# Altium schematic sheet CATZILLA.SchDoc: =DocumentName
size 420 x 297 mm; CompanyName: "AS Manufacturing" LLC; Organization: "AS Manufacturing" LLC; Address1: 5 Sklyarenka St.; Address2: Kyiv 04073; Address3: Ukraine; Address4: https://ajax.systems/en/; DocumentNumber: 3; SheetNumber: 3; SheetTotal: 6; Template_version: 1.0.1
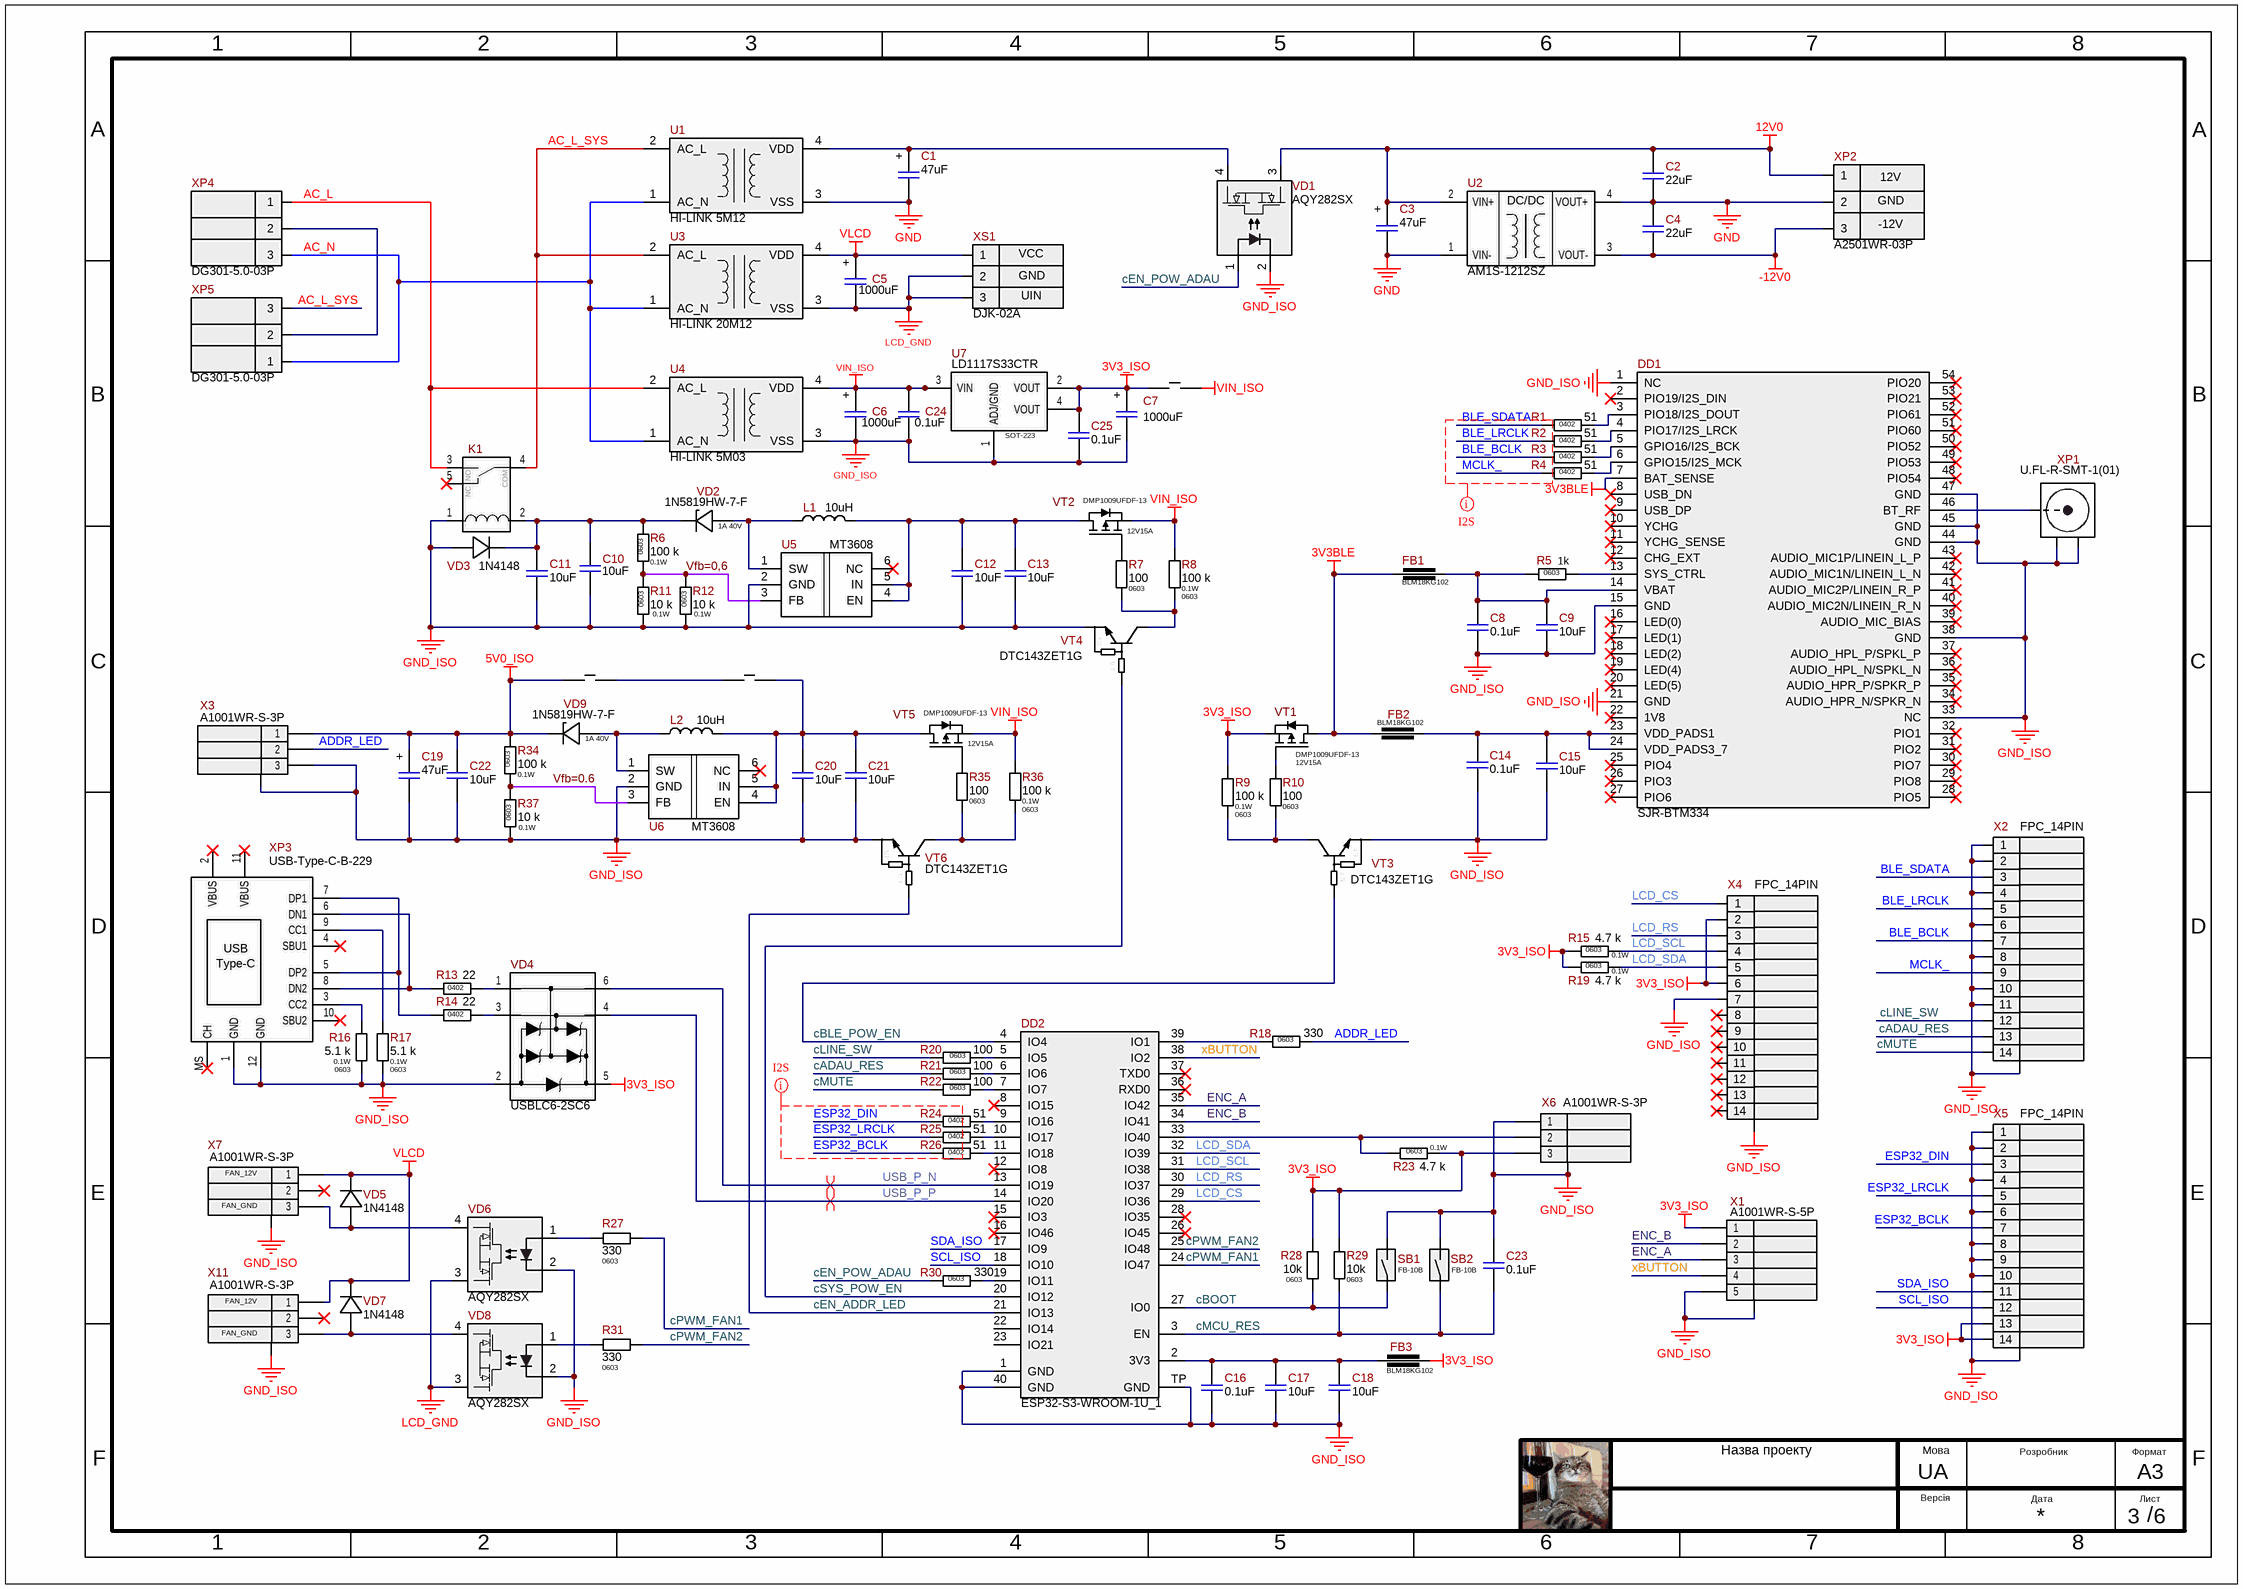
[diagram p0: CATZILLA.SchDoc]

## Parts
C1  47uF  [CAP 6.3x6]
C2  22uF  [C1206(3216)]
C3  47uF  [CAP 6.3x6]
C4  22uF  [C1206(3216)]
C5  1000uF  [CAP 10x16]
C6  1000uF  [CAP-AE-830x1000H50_HI]
C7  1000uF  [CAP-AE-830x1000H50_HI]
C8  0.1uF  [C0603(1608)]
C9  10uF  [C0603(1608)]
C10  10uF  [C0805(2012)]
C11  10uF  [C0805(2012)]
C12  10uF  [C0805(2012)]
C13  10uF  [C0805(2012)]
C14  0.1uF  [C0603(1608)]
C15  10uF  [C0603(1608)]
C16  0.1uF  [C0603(1608)]
C17  10uF  [C0603(1608)]
C18  10uF  [C0603(1608)]
C19  47uF  [CAP 6.3x6]
C20  10uF  [C0805(2012)]
C21  10uF  [C0805(2012)]
C22  10uF  [C0805(2012)]
C23  0.1uF  [C0603(1608)]
C24  0.1uF  [C0603(1608)]
C25  0.1uF  [C0603(1608)]
DD1  SJR-BTM334  [BTM334]
DD2  ESP32-S3-WROOM-1U_1  [ESP32-S3-WROOM-1U]
FB1  BLM18KG102  [BLM18(0603)]
FB2  BLM18KG102  [BLM18(0603)]
FB3  BLM18KG102  [BLM18(0603)]
K1  LEG-12  [Relay10A]  (value not drawn)
L1  10uH  [WE-LQS SMD 4018]
L2  10uH  [WE-LQS SMD 4018]
R1  51  Package/Case: 0402  [R0402]
R2  51  Package/Case: 0402  [R0402]
R3  51  Package/Case: 0402  [R0402]
R4  51  Package/Case: 0402  [R0402]
R5  1k  Package/Case: 0603  [R0603]
R6  100 k  Power Rating: 0.1W  Package/Case: 0603  [R0603]
R7  100  Package/Case: 0603  [R0603]
R8  100 k  Power Rating: 0.1W  Package/Case: 0603  [R0603]
R9  100 k  Power Rating: 0.1W  Package/Case: 0603  [R0603]
R10  100  Package/Case: 0603  [R0603]
R11  10 k  Package/Case: 0603  Power Rating: 0.1W  [R0603]
R12  10 k  Package/Case: 0603  Power Rating: 0.1W  [R0603]
R13  22  Package/Case: 0402  [R0402]
R14  22  Package/Case: 0402  [R0402]
R15  4.7 k  Power Rating: 0.1W  Package/Case: 0603  [R0603]
R16  5.1 k  Power Rating: 0.1W  Package/Case: 0603  [R0603]
R17  5.1 k  Power Rating: 0.1W  Package/Case: 0603  [R0603]
R18  330  Package/Case: 0603  [R0603]
R19  4.7 k  Power Rating: 0.1W  Package/Case: 0603  [R0603]
R20  100  Package/Case: 0603  [R0603]
R21  100  Package/Case: 0603  [R0603]
R22  100  Package/Case: 0603  [R0603]
R23  4.7 k  Power Rating: 0.1W  Package/Case: 0603  [R0603]
R24  51  Package/Case: 0402  [R0402]
R25  51  Package/Case: 0402  [R0402]
R26  51  Package/Case: 0402  [R0402]
R27  330  Package/Case: 0603  [R0603]
R28  10k  Package/Case: 0603  [R0603]
R29  10k  Package/Case: 0603  [R0603]
R30  330  Package/Case: 0603  [R0603]
R31  330  Package/Case: 0603  [R0603]
R34  100 k  Power Rating: 0.1W  Package/Case: 0603  [R0603]
R35  100  Package/Case: 0603  [R0603]
R36  100 k  Power Rating: 0.1W  Package/Case: 0603  [R0603]
R37  10 k  Package/Case: 0603  Power Rating: 0.1W  [R0603]
SB1  FB-10B  [FB-10B]
SB2  FB-10B  [FB-10B]
U1  HI-LINK 5M12  [HLINK_5MXX]
U2  AM1S-1212SZ  [SIP-4]
U3  HI-LINK 20M12  [HLINK_20MXX]
U4  HI-LINK 5M03  [HLINK_5MXX]
U5  MT3608  [SOT23-6]
U6  MT3608  [SOT23-6]
U7  Package: SOT-223  Part Number: LD1117S33CTR  [SOT223]  (hidden comment: LD1117STR)
VD1  AQY282SX  [SOP-4N]
VD2  1N5819HW-7-F  Power Rating: 1A 40V  [SOD-123]
VD3  1N4148  [SOD-80]
VD4  USBLC6-2SC6  [SOT-666]
VD5  1N4148  [D0805]
VD6  AQY282SX  [SOP-4N]
VD7  1N4148  [D0805]
VD8  AQY282SX  [SOP-4N]
VD9  1N5819HW-7-F  Power Rating: 1A 40V  [SOD-123]
VT1  DMP1009UFDF-13  Power Rating: 12V15A  [U-DFN2020-6_SLDR]
VT2  DMP1009UFDF-13  Power Rating: 12V15A  [U-DFN2020-6_SLDR]
VT3  DTC143ZET1G  [SOT-416]
VT4  DTC143ZET1G  [SOT-416]
VT5  DMP1009UFDF-13  Power Rating: 12V15A  [U-DFN2020-6_SLDR]
VT6  DTC143ZET1G  [SOT-416]
X1  A1001WR-S-5P  [A1001WR-S-05P]
X2  FPC_14PIN  [FPC-14-0.5mm]
X3  A1001WR-S-3P  [A1001WR-S-03P]
X4  FPC_14PIN  [FPC-14-0.5mm]
X5  FPC_14PIN  [FPC-14-0.5mm]
X6  A1001WR-S-3P  [A1001WR-S-03P]
X7  A1001WR-S-3P  [A1001WR-S-03P]
X8  Jumper 1.5х2  [NetTie1.5х2]  (value not drawn)  (net tie, no BOM)
X9  Jumper 1.5х2  [NetTie1.5х2]  (value not drawn)  (net tie, no BOM)
X10  Jumper 1.5х2  [NetTie1.5х2]  (value not drawn)  (net tie, no BOM)
X11  A1001WR-S-3P  [A1001WR-S-03P]
XP1  U.FL-R-SMT-1(01)  [IPEX_ RECE.20279.001E.01]
XP2  A2501WR-03P  [A2501WR-03P]
XP3  USB-Type-C-B-229  [USB-Type-C-B-229]
XP4  DG301-5.0-03P  [DG301-5.0-03P]
XP5  DG301-5.0-03P  [DG301-5.0-03P]
XS1  DJK-02A  [DC-140-003]

## Nets
3V3_ISO: C7.1 C25.1 FB3.2 R9.1 R15.2 R19.2 R23.2 R28.1 R29.1 U7.2(VOUT) U7.4(VOUT) VD4.5(VBUS) VT1.S X1.1 X4.2 X4.6 X5.13 X5.14 X6.3 X8.1
3V3BLE: DD1.7(BAT_SENSE) FB1.1 FB2.1 VT1.D
5V0_ISO: C19.1 C22.1 R34.2 VD9.1(K) X3.1 X9.1
12V0: C2.2 C3.1 U2.2(VIN+) VD1.3 XP2.1
-12V0: C4.1 U2.3(VOUT-) XP2.3
GND: C1.2 C2.1 C3.2 C4.2 U1.3(VSS) U2.1(VIN-) U2.4(VOUT+) XP2.2
GND_ISO: C6.2 C7.2 C8.1 C9.1 C10.2 C11.2 C12.2 C13.2 C14.2 C15.1 C16.1 C17.1 C18.1 C19.2 C20.2 C21.2 C22.2 C23.2 C24.2 C25.2 DD1.1(NC) DD1.15(GND) DD1.21(GND) DD1.33(NC) DD1.38(GND) DD1.44(GND) DD1.45(GND) DD1.47(GND) DD2.1(GND) DD2.40(GND) DD2.TP(GND) K1.1 R11.1 R12.1 R16.1 R17.1 R37.1 SB1.2 SB2.2 U4.3(VSS) U5.2(GND) U6.2(GND) U7.1(ADJ/GND) VD1.2(GND) VD3.2(A) VD4.2(GND) VD6.2(GND) VD8.2(GND) VT3.2(E) VT4.2(E) VT6.2(E) X1.5 X1.MP(MountPad) X2.1 X2.2 X2.4 X2.6 X2.8 X2.10 X2.11 X2.15 X3.3 X3.MP(MountPad) X4.7 X4.15 X5.1 X5.2 X5.4 X5.6 X5.8 X5.9 X5.10 X5.15 X6.1 X6.MP(MountPad) X7.MP(MountPad) X11.MP(MountPad) XP1.2 XP1.3 XP3.1(GND) XP3.12(GND)
LCD_GND: C5.2 U3.3(VSS) VD6.3 VD8.3 XS1.2 XS1.3
VIN_ISO: C6.1 C24.1 R8.2 R36.2 U4.4(VDD) U7.3(VIN) VT2.S VT5.S X8.2
VLCD: C5.1 U3.4(VDD) VD5.1(K) VD7.1(K) X7.1 X11.1 XS1.1
AC_L: K1.3(NO) U4.2(AC_L) XP4.1
AC_L_SYS: K1.4(COM) U1.2(AC_L) U3.2(AC_L) XP5.3
AC_N: U1.1(AC_N) U3.1(AC_N) U4.1(AC_N) XP4.3 XP5.1
ADDR_LED: R18.1 X3.2
BLE_BCLK: R3.2 X2.7
BLE_LRCLK: R2.2 X2.5
BLE_SDATA: R1.2 X2.3
cADAU_RES: R21.1 X2.13
cBLE_POW_EN: DD2.4(IO4) VT3.1(B)
cBOOT: DD2.27(IO0) R28.2 SB1.1
cEN_ADDR_LED: DD2.21(IO13) VT6.1(B)
cEN_POW_ADAU: R30.2 VD1.1(VIN)
cLINE_SW: R20.1 X2.12
cMCU_RES: C23.1 DD2.3(EN) R29.2 SB2.1
cMUTE: R22.1 X2.14
cPWM_FAN1: DD2.24(IO47) R27.1
cPWM_FAN2: DD2.25(IO48) R31.1
cSYS_POW_EN: DD2.20(IO12) VT4.1(B)
ENC_A: DD2.35(IO42) X1.3
ENC_B: DD2.34(IO41) X1.2
ESP32_BCLK: R26.2 X5.7
ESP32_DIN: R24.2 X5.3
ESP32_LRCLK: R25.2 X5.5
LCD_CS: DD2.29(IO36) X4.1
LCD_RS: DD2.30(IO37) X4.3
LCD_SCL: DD2.31(IO38) R15.1 X4.4
LCD_SDA: DD2.32(IO39) R19.1 X4.5
MCLK_: R4.2 X2.9
SCL_ISO: DD2.18(IO10) X5.12
SDA_ISO: DD2.17(IO9) X5.11
USB_P_N: DD2.13(IO19) VD4.6(D+OUT)
USB_P_P: DD2.14(IO20) VD4.4(D-OUT)
Vfb=0,6: R6.1 R11.2 R12.2 U5.3(FB)
Vfb=0.6: R34.1 R37.2 U6.3(FB)
xBUTTON: DD2.38(IO2) X1.4
NetC1_1: C1.1 U1.4(VDD) VD1.4
NetC8_2: C8.2 C9.2 DD1.14(VBAT) FB1.2 R5.1
NetC10_1: C10.1 C11.1 K1.2 R6.2 VD2.1(K) VD3.1(K)
NetC12_1: C12.1 C13.1 L1.1 U5.4(EN) U5.5(IN) VT2.D
NetC14_1: C14.1 C15.2 DD1.23(VDD_PADS1) DD1.24(VDD_PADS3_7) FB2.2
NetC16_2: C16.2 C17.2 C18.2 DD2.2(3V3) FB3.1
NetC20_1: C20.1 C21.1 L2.1 U6.4(EN) U6.5(IN) VT5.D X10.2
NetDD1_3: DD1.3(PIO18/I2S_DOUT) R1.1
NetDD1_4: DD1.4(PIO17/I2S_LRCK) R2.1
NetDD1_5: DD1.5(GPIO16/I2S_BCK) R3.1
NetDD1_6: DD1.6(GPIO15/I2S_MCK) R4.1
NetDD1_13: DD1.13(SYS_CTRL) R5.2
NetDD1_46: DD1.46(BT_RF) XP1.1
NetDD2_5: DD2.5(IO5) R20.2
NetDD2_6: DD2.6(IO6) R21.2
NetDD2_7: DD2.7(IO7) R22.2
NetDD2_9: DD2.9(IO16) R24.1
NetDD2_10: DD2.10(IO17) R25.1
NetDD2_11: DD2.11(IO18) R26.1
NetDD2_19: DD2.19(IO11) R30.1
NetDD2_33: DD2.33(IO40) R23.1 X6.2
NetDD2_39: DD2.39(IO1) R18.2
NetL1_2: L1.2 U5.1(SW) VD2.2(A)
NetL2_2: L2.2 U6.1(SW) VD9.2(A)
NetR7_1: R7.1 R8.1 VT4.3(C)
NetR7_2: R7.2 VT2.G
NetR9_2: R9.2 R10.1 VT3.3(C)
NetR10_2: R10.2 VT1.G
NetR13_1: R13.1 XP3.6(DN1) XP3.8(DN2)
NetR13_2: R13.2 VD4.1(D+IN)
NetR14_1: R14.1 XP3.5(DP2) XP3.7(DP1)
NetR14_2: R14.2 VD4.3(D-IN)
NetR16_2: R16.2 XP3.3(CC2)
NetR17_2: R17.2 XP3.9(CC1)
NetR27_2: R27.2 VD6.1(VIN)
NetR31_2: R31.2 VD8.1(VIN)
NetR35_1: R35.1 R36.1 VT6.3(C)
NetR35_2: R35.2 VT5.G
NetVD5_2: VD5.2(A) VD6.4 X7.3
NetVD7_2: VD7.2(A) VD8.4 X11.3
NetX9_2: X9.2 X10.1
NetXP4_2: XP4.2 XP5.2

Not connected (* = marked no-connect by the designer): DD1 2(PIO19/I2S_DIN)* 8(USB_DN)* 9(USB_DP)* 10(YCHG)* 11(YCHG_SENSE)* 12(CHG_EXT)* 16(LED(0))* 17(LED(1))* 18(LED(2))* 19(LED(4))* 20(LED(5))* 22(1V8)* 25(PIO4)* 26(PIO3)* 27(PIO6)* 28(PIO5)* 29(PIO8)* 30(PIO7)* 31(PIO2)* 32(PIO1)* 34(AUDIO_HPR_N/SPKR_N)* 35(AUDIO_HPR_P/SPKR_P)* 36(AUDIO_HPL_N/SPKL_N)* 37(AUDIO_HPL_P/SPKL_P)* 39(AUDIO_MIC_BIAS)* 40(AUDIO_MIC2N/LINEIN_R_N)* 41(AUDIO_MIC2P/LINEIN_R_P)* 42(AUDIO_MIC1N/LINEIN_L_N)* 43(AUDIO_MIC1P/LINEIN_L_P)* 48(PIO54)* 49(PIO53)* 50(PIO52)* 51(PIO60)* 52(PIO61)* 53(PIO21)* 54(PIO20)*; DD2 8(IO15)* 12(IO8)* 15(IO3)* 16(IO46)* 22(IO14) 23(IO21) 26(IO45)* 28(IO35)* 36(RXD0)* 37(TXD0)*; K1 5(NC)*; U5 6(NC)*; U6 6(NC)*; X4 8* 9* 10* 11* 12* 13* 14*; X7 2*; X11 2*; XP3 2(VBUS)* 4(SBU1)* 10(SBU2)* 11(VBUS)* MS(CH)*

## Layout directives
net class I2S2: ESP32_BCLK, ESP32_DIN, ESP32_LRCLK
net class I2S1: BLE_BCLK, BLE_LRCLK, BLE_SDATA, MCLK_
differential pair; net class USB: USB_P_N, USB_P_P

## Notes on the sheet
- (near XP2) 12V
- (near XP2) -12V
- (near XP2) GND
- (near X7) FAN_GND
- (near X7) FAN_12V
- (near X11) FAN_GND
- (near X11) FAN_12V
- 1
- 2
- 3
- 4
- 5
- 6
- 7
- 8
- A
- B
- C
- D
- E
- F
- Назва проекту
- Мова
- UA
- Розробник
- Формат
- A3
- Версія
- Дата
- Лист
- /
- (in symbol 47uF  25V 6.3х5.3) +
- (in symbol 1000uF  6.3V Size E D8x10.5mm) +
- (in symbol 1000uF  16V 10x16(EHR)) +
- (in symbol AM1S-1212SZ) DC/DC
- (in symbol DJK-02A) VCC; GND; UIN
- (in symbol DTC143ZET1G) 47k; 4.7k
- (in symbol USB-Type-C-B-229) USB; Type-C

## Library data of the parts
C1 C3 C19 = 47uF  25V 6.3х5.3: CAP ALUM POLY 47UF 10% 25V SMD; Manufacturer: SAMWHA; Manufacturer P/N: SMDCAP47mkf25v; Name Component: Aluminum - Polymer Capacitors; Operation Temperature: -55°C ~ 125°C; Library Path 1: Capacitors.SchLib; Part Number: 47uF  25V 6.3х5.3; Value: 47uF; Tolerance: ±10%; Power (V/A): 25V; Package/Case: 6.3х5.3; Supplier 1: kosmodrom; Supplier Part Number 1: 00-00049951; ComponentLink1Description: Datasheet; ComponentLink1URL: http://www.kosmodrom.com.ua/pdf/SMD-RC-105C.pdf
C2 C4 = 22uF  25V С1206: CAP CER 22UF 25V X5R 1206; Manufacturer: Samsung Electro-Mechanics; Manufacturer P/N: CL31A226KAHNNNE; Name Component: Capacitor Ceramic; Tolerance: ±10%; Operation Temperature: -55°C ~ 85°C; Notes: 12063D226KAT2A; Library Path 1: Capacitors.SchLib; Part Number: 22uF  25V С1206; Value: 22uF; Temperature Coefficient: X5R; Power (V/A): 25V; Package/Case: С1206; Supplier 1: Digi-key; Supplier Part Number 1: 1276-3047-2-ND; ComponentLink1Description: Datasheet; ComponentLink1URL: https://www.samsungsem.com/resources/file/global/support/product_catalog/MLCC.pdf
C5 = 1000uF  16V 10x16(EHR): 1000uF 20% 16V EHR 10x16mm; Manufacturer: Hitano; Manufacturer P/N: EHR102M16BA; Name Component: Electrolytic capacitor; Operation Temperature: −40°C to +105°C; Library Path 1: Capacitors.SchLib; Part Number: 1000uF  16V 10x16(EHR); Value: 1000uF; Tolerance: ±20%; Power (V/A): 16V; Package/Case: 10x16(EHR); Supplier 1: RCS; ComponentLink1Description: Datasheet; ComponentLink1URL: https://www.rcscomponents.kiev.ua/datasheets/EHR_081225.pdf
C6 C7 = 1000uF  6.3V Size E D8x10.5mm: 1000uF 6.3V Size E D8x10.5mm; Manufacturer: Panasonic Electronic Components; Name Component: Aluminum - Polymer Capacitors; Tolerance: 10%; Operation Temperature: -55°C ~ 85°C; Library Path 1: Capacitors.SchLib; Part Number: 1000uF  6.3V Size E D8x10.5mm; Value: 1000uF; Power (V/A): 6.3V; Package/Case: Size E D8x10.5mm
C8 C14 C16 C23-C25 = 0.1uF  50V C0603: CAP CER 0.1UF 50V X7R 0603; Manufacturer: Samsung Electro-Mechanics; Manufacturer P/N: CL10B104KB8WPNC; Name Component: Capacitor Ceramic; Tolerance: ±10%; Operation Temperature: -55°C ~ 125°C; Library Path 1: Capacitors.SchLib; Notes: 06035C104K4T4A, 06035C104K4T2A; Part Number: 0.1uF  50V C0603; Value: 0.1uF; Temperature Coefficient: X7R; Power (V/A): 50V; Package/Case: C0603; Supplier Part Number 1: 1276-6854-2-ND; ComponentLink1Description: Datasheet; Supplier 1: Digi-key; ComponentLink1URL: https://www.samsungsem.com/resources/file/global/support/product_catalog/MLCC.pdf
C9 C15 C17 C18 = 10uF  35V C0603: CAP CER 10UF 35V X5R 0603; Manufacturer: Murata Electronics North America; Manufacturer P/N: GRM188R6YA106MA73D; Name Component: Capacitor Ceramic; Tolerance: ±20%; Operation Temperature: -55°C ~ 105°C; Library Path 1: Capacitors.SchLib; Part Number: 10uF  35V C0603; Value: 10uF; Temperature Coefficient: X5R; Power (V/A): 35V; Package/Case: C0603; Supplier 1: Digi-key; Supplier Part Number 1: 490-13248-2-ND; ComponentLink1Description: Datasheet; ComponentLink1URL: https://search.murata.co.jp/Ceramy/image/img/A01X/G101/ENG/GRM188R6YA106MA73-01.pdf
C10-C13 C20-C22 = 10uF  16V C0805: CAP CER 10UF 16V X6S 0805; Manufacturer: Murata Electronics North America; Manufacturer P/N: GRM21BC81C106KA73L; Name Component: Capacitor Ceramic; Tolerance: ±10%; Operation Temperature: -55°C ~ 105°C; Library Path 1: Capacitors.SchLib; Part Number: 10uF  16V C0805; Value: 10uF; Temperature Coefficient: X6S; Power (V/A): 16V; Package/Case: C0805; Supplier 1: Digi-key; Supplier Part Number 1: 490-5519-2-ND; ComponentLink1Description: Datasheet; ComponentLink1URL: https://www.murata.com/~/media/webrenewal/support/library/catalog/products/capacitor/mlcc/c02e.ashx?la=en-us
DD1 = SJR-BTM334: Bluetooth 5.1 audio module, QCC3034 chipset; Name Component: Bluetooth Module; Operation Temperature: -40°C ~ 85°C; Power (V/A): 2.8 ~ 34.3 V; Library Path 1: Module.SchLib; Part Number: SJR-BTM334; Value: SJR-BTM334; Package/Case: 13×18 mm; ComponentLink1Description: Datasheet; ComponentLink1URL: https://tianjiarun-1251103446.cos.ap-guangzhou.myqcloud.com/zb_users/upload/2020/04/SJR-BTM334_SPEC.pdf
DD2 = ESP32-S3-WROOM-1U_1: ESP32-S3-WROOM-1U-N16R8; Name Component: MCU Module; Operation Temperature: -40°C ~ 85°C; Power (V/A): 3.0 ~ 3.6 V; Library Path 1: Module.SchLib; Part Number: ESP32-S3-WROOM-1U_1; Value: ESP32-S3-WROOM-1U_1; ComponentLink1Description: Datasheet; ComponentLink1URL: https://www.espressif.com/sites/default/files/documentation/esp32-wroom-32e_esp32-wroom-32ue_datasheet_en.pdf
FB1-FB3 = BLM18KG102: FERRITE BEAD 1 KOHM 0603 1LN; Manufacturer: Murata Electronics North America; Manufacturer P/N: BLM18KG102SN1D; Name Component: Ferrite Beads; Tolerance: ±25%; Power (V/A): 1A; Library Path 1: Inductance.SchLib; Part Number: BLM18KG102; Value: BLM18KG102; Package/Case: 0603 (1608 Metric); Supplier 1: Digi-key; Supplier Part Number 1: 490-17349-2-ND; ComponentLink1Description: Datasheet; ComponentLink1URL: https://media.digikey.com/pdf/Data%20Sheets/Murata%20PDFs/BLM18yyyyyyN1x.pdf
K1 = LEG-12: General Purpose Relay, 1 Form C (1PDT), 12VDC 400Ohm Coil, 120VAC/24VDC @ 10A, 240VAC Max; Operation Temperature: -55°C ~ 125°C (TA); Power (V/A): 12V; Library Path 1: Others.SchLib; ComponentLink1URL: https://www.tme.eu/Document/311affc211749c2a4c93ad074af62b72/LEG-SERIES.pdf; ComponentLink1Description: Datasheet; Part Number: LEG-12; Name Component: Relay; Value: LEG-12; Supplier Part Number 1: Relay10A
L1 L2 = NRS4018T3R3: FIXED IND 10UH 1A 66 MOHM SMD; Manufacturer: TaiyoYuden; Manufacturer P/N: NRS4018T3R3MDGJ; Name Component: Fixed Inductors; Tolerance: ±20; Operation Temperature: -25°C ~ 120°C; Power (V/A): 2A; Library Path 1: Inductance.SchLib; Part Number: NRS4018T3R3; Value: 10uH; Package/Case: 4.00mm x 4.00mm; Supplier 1: Digi-key; Supplier Part Number 1: 587-2892-2-ND; ComponentLink1Description: Datasheet; ComponentLink1URL: https://www.yuden.co.jp/productdata/catalog/wound04_e.pdf
R1-R4 R24-R26 = 51  R0402: RES SMD 51 OHM  ±1% 1/16W 0402; Power Rating: 0.063W; Name Component: Resistror; Operation Temperature: -55℃ to 155℃; Temperature Coefficient: ±100 ppm/°C; Library Path 1: Resistor.SchLib; Part Number: 51  R0402; Value: 51; Tolerance: ±1%
R5 = 10 k  R0603: RES SMD 10 k OHM  ±1% 1/10W 0603; Power Rating: 0.1W; Name Component: Resistror; Value: 10 k; Operation Temperature: -55℃ to 155℃; Temperature Coefficient: ±100 ppm/°C; Library Path 1: Resistor.SchLib; Part Number: 10 k  R0603; Tolerance: ±1%
R6 R8 R9 R34 R36 = 100 k  R0603: RES SMD 100 k OHM  ±1% 1/10W 0603; Name Component: Resistror; Operation Temperature: -55℃ to 155℃; Temperature Coefficient: ±100 ppm/°C; Library Path 1: Resistor.SchLib; Part Number: 100 k  R0603; Value: 100 k; Tolerance: ±1%
R7 R10 R20-R22 R35 = 100  R0603: RES SMD 100 OHM  ±1% 1/10W 0603; Power Rating: 0.1W; Name Component: Resistror; Operation Temperature: -55℃ to 155℃; Temperature Coefficient: ±100 ppm/°C; Library Path 1: Resistor.SchLib; Part Number: 100  R0603; Value: 100; Tolerance: ±1%
R11 R12 R37 = 10 k  R0603: RES SMD 10 k OHM  ±1% 1/10W 0603; Name Component: Resistror; Operation Temperature: -55℃ to 155℃; Temperature Coefficient: ±100 ppm/°C; Library Path 1: Resistor.SchLib; Part Number: 10 k  R0603; Value: 10 k; Tolerance: ±1%
R13 R14 = 22  R0402: RES SMD 22 OHM  ±1% 1/16W 0402; Power Rating: 0.063W; Name Component: Resistror; Operation Temperature: -55℃ to 155℃; Temperature Coefficient: ±100 ppm/°C; Library Path 1: Resistor.SchLib; Part Number: 22  R0402; Value: 22; Tolerance: ±1%
R15 R19 R23 = 4.7 k  R0603: RES SMD 4.7 k OHM  ±1% 1/10W 0603; Name Component: Resistror; Operation Temperature: -55℃ to 155℃; Temperature Coefficient: ±100 ppm/°C; Library Path 1: Resistor.SchLib; Part Number: 4.7 k  R0603; Value: 4.7 k; Tolerance: ±1%
R16 R17 = 5.1 k  R0603: RES SMD 5.1 k OHM  ±1% 1/10W 0603; Name Component: Resistror; Operation Temperature: -55℃ to 155℃; Temperature Coefficient: ±100 ppm/°C; Library Path 1: Resistor.SchLib; Part Number: 5.1 k  R0603; Value: 5.1 k; Tolerance: ±1%
R18 R27 R30 R31 = 330  R0603: RES SMD 330 OHM  ±1% 1/10W 0603; Power Rating: 0.1W; Name Component: Resistror; Operation Temperature: -55℃ to 155℃; Temperature Coefficient: ±100 ppm/°C; Library Path 1: Resistor.SchLib; Part Number: 330  R0603; Value: 330; Tolerance: ±1%
R28 R29 = 10 k  R0603: RES SMD 10 k OHM  ±1% 1/10W 0603; Power Rating: 0.1W; Name Component: Resistror; Operation Temperature: -55℃ to 155℃; Temperature Coefficient: ±100 ppm/°C; Library Path 1: Resistor.SchLib; Part Number: 10 k  R0603; Value: 10 k; Tolerance: ±1%
SB1 SB2 = FB-10B: Name Component: Switch; Operation Temperature: -20°C ~ 70°C; Library Path 1: Switches.SchLib; Value: FB-10B; Footprint_name: *; Part Number: FB-10B
U1 = HI-LINK 5M12: 85-264VAC  5W 12V 0.45A; Name Component: AC-DC; Operation Temperature: -40°C ~ 85°C; Library Path 1: Module.SchLib; Part Number: HI-LINK 5M12; Value: HI-LINK 5M12; Power (V/A): 12V; ComponentLink1Description: Datasheet
U2 = AM1S-1212SZ: Isolated Module DC DC Converter, 1 Output 12V 83mA, 10.8V - 13.2V Input; Name Component: DC-DC; Operation Temperature: -40°C ~ 85°C; Library Path 1: Module.SchLib; Part Number: AM1S-1212SZ; Value: AM1S-1212SZ; Power (V/A): 10.8V - 13.2V; Package/Case: SIP-4; ComponentLink1Description: Datasheet; ComponentLink1URL: http://www.aimtec.com/site/Aimtec/files/Datasheet/HighResolution/AM1S-Z.pdf
U3 = HI-LINK 20M12: 85-264VAC  20W 12V 1.6A; Name Component: AC-DC; Operation Temperature: -40°C ~ 85°C; Power (V/A): 12V 1.6AmA; Library Path 1: Module.SchLib; Part Number: HI-LINK 20M12; Value: HI-LINK 20M12; ComponentLink1Description: Datasheet
U4 = HI-LINK 5M03: 85-264VAC  5W 3.3V 1.5A; Name Component: AC-DC; Operation Temperature: -40°C ~ 85°C; Library Path 1: Module.SchLib; Part Number: HI-LINK 5M03; Value: HI-LINK 5M03; Power (V/A): 3.3 V 1.5A; ComponentLink1Description: Datasheet
U5 U6 = MT3608: HIGH EFFICIENCY 1.2MHZ 2A STEP UP CONVERTER; Manufacturer: AEROSEMI; Manufacturer P/N: MT3608 AEROSEMI; Name Component: Power converters; Operation Temperature: -40°C ~ 125°C; Library Path 1: Power converters.SchLib; ComponentDescription: Power converters  MT3608  (SOT23-6); Part Number: MT3608; Value: MT3608; Power (V/A): 2 A; Package/Case: SOT23-6; Supplier 1: -; Supplier Part Number 1: -; ComponentLink1Description: Datasheet; ComponentLink1URL: http://mini-tech.com.ua/download/datasheet/power_supply/MT3608.pdf
U7 = LD1117S33CTR: IC REG LINEAR 3.3V 800MA SOT223; Manufacturer: STMicroelectronics; Name Component: Linear Regulators; Operation Temperature: -40°C ~ 125°C; Power (V/A): 0.8 A 3.3 В; Library Path 1: Power converters.SchLib; ComponentDescription: Linear Regulators  LD1117S33CTR  (SOT-223); Part Type: Power / Linear Regulator; Component Type: SMD; Temperature Range: 0°C ~ 125°C; ComponentLink1URL: https://www.st.com/content/ccc/resource/technical/document/datasheet/99/3b/7d/91/91/51/4b/be/CD00000544.pdf/files/CD00000544.pdf/jcr:content/translations/en.CD00000544.pdf; Supplier 1: Digi-key; Supplier Part Number 1: 497-1241-2-ND; Price: 0,11994941; ComponentLink1Description: Datasheet; Value: LD1117S33CTR; Package/Case: SOT-223; Manufacturer P/N: LD1117S33CTR
VD1 VD6 VD8 = AQY282SX: SSR RELAY SPST-NO 500MA 0-60V; Manufacturer: Panasonic Electric Works; Name Component: Optotransistor; Operation Temperature: -40 ~ +85; Power (V/A): 0 V ~ 60 V; Library Path 1: Opto.SchLib; Part Number: AQY282SX; Value: AQY282SX; Package/Case: 4-SOP; Supplier 1: Digi-key; ComponentLink1Description: Datasheet; ComponentLink1URL: https://media.digikey.com/pdf/Data%20Sheets/Panasonic%20Electric%20Works%20PDFs/AQW,AQY280,282,284.pdf
VD2 VD9 = 1N5819HW-7-F: DIODE SCHOTTKY 40V 1A SOD-123; Manufacturer: Diodes Incorporated; Library Path 1: Diodes.SchLib; Part Number: 1N5819HW-7-F; Name Component: Diode Schottky; Value: 1N5819HW-7-F; Package/Case: SOD-123; Supplier 1: Kosmodrom; ComponentLink1Description: Datasheet; ComponentLink1URL: https://www.mouser.com/datasheet/2/115/DIOD_S_A0011683586_1-2543674.pdf?srsltid=AfmBOooSNGKg6kFHsm5EDerUk8pACA_mvoqB5hN7nSVKhWQ3aDU_xIdt
VD3 VD5 VD7 = 1N4148: DIODE GEN PURP 75V 250MA SOD323; Manufacturer: Diodes Incorporated; Operation Temperature: -55°C ~ 150°C; Library Path 1: Diodes.SchLib; Power Rating: 75V 250mA; Part Number: 1N4148; Name Component: Diode; Value: 1N4148; Package/Case: SOD-80; Manufacturer P/N: 1N4148; Supplier 1: Digi-key; Supplier Part Number 1: 1N4148; ComponentLink1Description: Datasheet
VD4 = USBLC6-2SC6: TVS DIODE 5.25V 17V SOT23-6; Manufacturer: STMicroelectronics; Name Component: TVS - Diodes; Operation Temperature: -40°C ~ 125°C (TJ); Power Rating: 17V 5A; Library Path 1: Diodes.SchLib; ComponentLink1URL: https://www.st.com/resource/en/datasheet/usblc6-2.pdf; ComponentLink1Description: Datasheet; Part Number: USBLC6-2SC6; Value: USBLC6-2SC6; Package/Case: SOT-23-6; Manufacturer P/N: USBLC6-2SC6; Supplier 1: Digi-key; Supplier Part Number 1: 497-5235-2-ND
VT1 VT2 VT5 = DMP1009UFDF-13: P-Channel 12 V 15A (Ta) 2W (Ta) Surface Mount U-DFN2020-6 (Type F); Manufacturer: Diodes Incorporated; Name Component: Transistor; Operation Temperature: -55°C ~ 150°C (TJ); Library Path 1: Transistors.SchLib; ComponentLink1URL: https://www.diodes.com/assets/Datasheets/DMP1009UFDF.pdf; ComponentLink1Description: Datasheet; Part Number: DMP1009UFDF-13; Value: DMP1009UFDF-13; Package/Case: U-DFN2020-6 (Type F); Manufacturer P/N: DMP1009UFDF-13; Supplier 1: Digi-key; Supplier Part Number 1: DMP1009UFDF-13-ND
VT3 VT4 VT6 = DTC143ZET1G: TRANS PREBIAS NPN 50V 100MA SC75; Manufacturer: onsemi; Name Component: Transistor; Operation Temperature: -55°C ~ 150°C (TJ); Power Rating: 100mA 50V; Library Path 1: Transistors.SchLib; Part Number: DTC143ZET1G; Value: DTC143ZET1G; Package/Case: SOT-416; Manufacturer P/N: DTC143ZET1G; Supplier 1: Digi-key; Supplier Part Number 1: DTC143ZET1GOSTR-ND; ComponentLink1Description: Datasheet; ComponentLink1URL: https://www.onsemi.com/pdf/datasheet/dtc143z-d.pdf
X1 = A1001WR-S-5P: CONN HEADER 5POS 1MM; Manufacturer: Joint Tech; Ajax_1C_PN: NONE; Ajax_1С_Status: RND Only; Component Status: Review_1; Replacement: SM05B-SRSS-TB; Name Component: Rectangular Connectors - Headers; Operation Temperature: -25...85°C; Power (V/A): 1А 50В; Library Path 1: Connectors.SchLib; Part Type: Wire-to-Board / 1mm; Component Type: SMD; Temperature Range: -40°C ~ 105°C; ComponentLink1URL: https://www.tme.eu/Document/82e53032519d6eb0cf96ad88610f3e77/A1001WR-S-XP---12B5.pdf; Price: NONE; ComponentLink1Description: Datasheet; Part Number: A1001WR-S-5P; Value: A1001WR-S-5P; Package/Case: 1mm; Manufacturer P/N: A1001WR-S-5P; Supplier 1: Kosmodrom
X2 X4 X5 = FPC_14PIN: FPC CONNECTOR; Library Path 1: Connectors.SchLib; Part Number: FPC_14PIN; Name Component: FPC_14PIN; Value: FPC_14PIN; ComponentLink1Description: Datasheet
X3 X6 X7 X11 = A1001WR-S-3P: CONN HEADER 3POS 1MM; Manufacturer: Joint Tech; Ajax_1C_PN: NONE; Ajax_1С_Status: RND Only; Component Status: Review_1; Replacement: SM03B-SRSS-TB; Name Component: Rectangular Connectors - Headers; Operation Temperature: -25...85°C; Power (V/A): 1А 50В; Library Path 1: Connectors.SchLib; Part Type: Wire-to-Board / 1mm; Component Type: SMD; Temperature Range: -40°C ~ 105°C; ComponentLink1URL: https://www.tme.eu/Document/82e53032519d6eb0cf96ad88610f3e77/A1001WR-S-XP---12B5.pdf; Price: NONE; ComponentLink1Description: Datasheet; Part Number: A1001WR-S-3P; Value: A1001WR-S-3P; Package/Case: 1mm; Manufacturer P/N: A1001WR-S-3P; Supplier 1: Kosmodrom
X8-X10 = Jumper 1.5х2: Jumper 1.5mm x 2mm; Library Path 1: Others.SchLib; ComponentDescription: Jumper  Jumper 1.5х2  (1.5mm x 2mm); Part Number: Jumper 1.5х2; Name Component: Jumper; Value: Jumper 1.5х2; Package/Case: 1.5mm x 2mm; ComponentLink1Description: Datasheet; AbridgedComponentDescription: Jumper 1.5х2
XP1 = U.FL-R-SMT-1(01): CONN UMC RCPT STR 50 OHM SMD; Manufacturer: HIROSE; Name Component: U.FL (IPX/AMC); Operation Temperature: -10°C …. 40°C; Library Path 1: Connectors.SchLib; Part Number: U.FL-R-SMT-1(01); Value: U.FL-R-SMT-1(01); Package/Case: Male Pin; Manufacturer P/N: U.FL-R-SMT-1(01); Supplier 1: TME; ComponentLink1Description: Datasheet; ComponentLink1URL: https://www.tme.eu/ua/ru/details/u.fl-r-smt-1-01/mikrorazemy/hirose/u-fl-r-smt-1-01/
XP2 = A2501WR-03P: PIN: 3; A2501; 3A; 250V; UL94V-0; Manufacturer: JOINT TECH; Name Component: Power Connectors; Operation Temperature: -40°C ~ 80°C; Library Path 1: Connectors.SchLib; Part Number: A2501WR-03P; Value: A2501WR-03P; Supplier 1: RCS; ComponentLink1Description: Datasheet; ComponentLink1URL: https://documents.tme.eu/v7/_solaris-tep_/pVersion=0046&contRep=ZT&docId=005056AB752F1EE383C6617DFE942CAD&compId=A2501WV-XP.pdf?ci_sign=9baf55e1d4ede3a69cd97522aa56fece6c405150
XP3 = USB-Type-C-B-229: Manufacturer: KLS ELECTRONIC CO., LTD.; Operation Temperature: -55 °C to +105 °C; Power (V/A): 3А 250В; Library Path 1: Connectors.SchLib; Part Number: USB-Type-C-B-229; Name Component: USB-Type-C; Value: USB-Type-C-B-229; Package/Case: USB-Type-C-B-229; Supplier 1: Kosmodrom; ComponentLink1Description: Datasheet; ComponentLink1URL: http://www.kosmodrom.com.ua/pdf/USB-Type-C-B-229.pdf
XP4 XP5 = DG301-5.0-03P: Library Path 1: Connectors.SchLib; Part Number: DG301-5.0-03P; Value: DG301-5.0-03P
XS1 = DJK-02A: DC POWER JACK CONNECTOR 6.3MM; Manufacturer: KLS; Name Component: Power socket; Operation Temperature: -25°C ~ 85°C; Power (V/A): 2A/250V; Library Path 1: Connectors.SchLib; Part Number: DJK-02A; Value: DJK-02A; Package/Case: DJK-02A; Manufacturer P/N: DJK-02A; Supplier 1: -; ComponentLink1Description: Datasheet; ComponentLink1URL: https://static.chipdip.ru/lib/078/DOC001078433.pdf; System: Connector